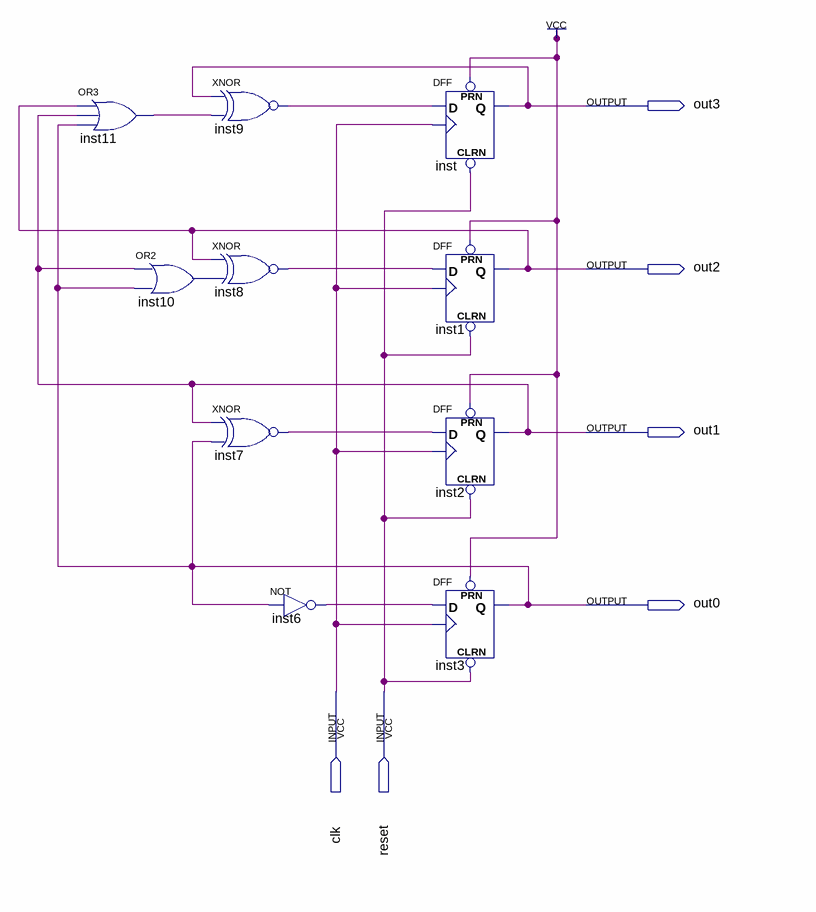
[diagram p0: schematic sheet]
// Quartus schematic SynchDownCounter.bdf as structural Verilog: 10 symbols, 6 pins
module SynchDownCounter (
  input  clk,
  input  reset,
  output out3,
  output out2,
  output out1,
  output out0
);

  wire inst6_out, inst7_out, inst8_out, inst9_out, inst10_out, inst11_out;

  or inst11 (inst11_out, out2, out1, out0);
  or inst10 (inst10_out, out1, out0);
  xnor inst9 (inst9_out, out3, inst11_out);
  xnor inst8 (inst8_out, out2, inst10_out);
  xnor inst7 (inst7_out, out1, out0);
  not inst6 (inst6_out, out0);
  DFF inst (.CLRN(reset), .CLK(clk), .D(inst9_out), .PRN(1'b1), .Q(out3));
  DFF inst1 (.CLRN(reset), .CLK(clk), .D(inst8_out), .PRN(1'b1), .Q(out2));
  DFF inst2 (.CLRN(reset), .CLK(clk), .D(inst7_out), .PRN(1'b1), .Q(out1));
  DFF inst3 (.CLRN(reset), .CLK(clk), .D(inst6_out), .PRN(1'b1), .Q(out0));
endmodule
